# EAGLE design schematic (EAGLE 9.5.2)
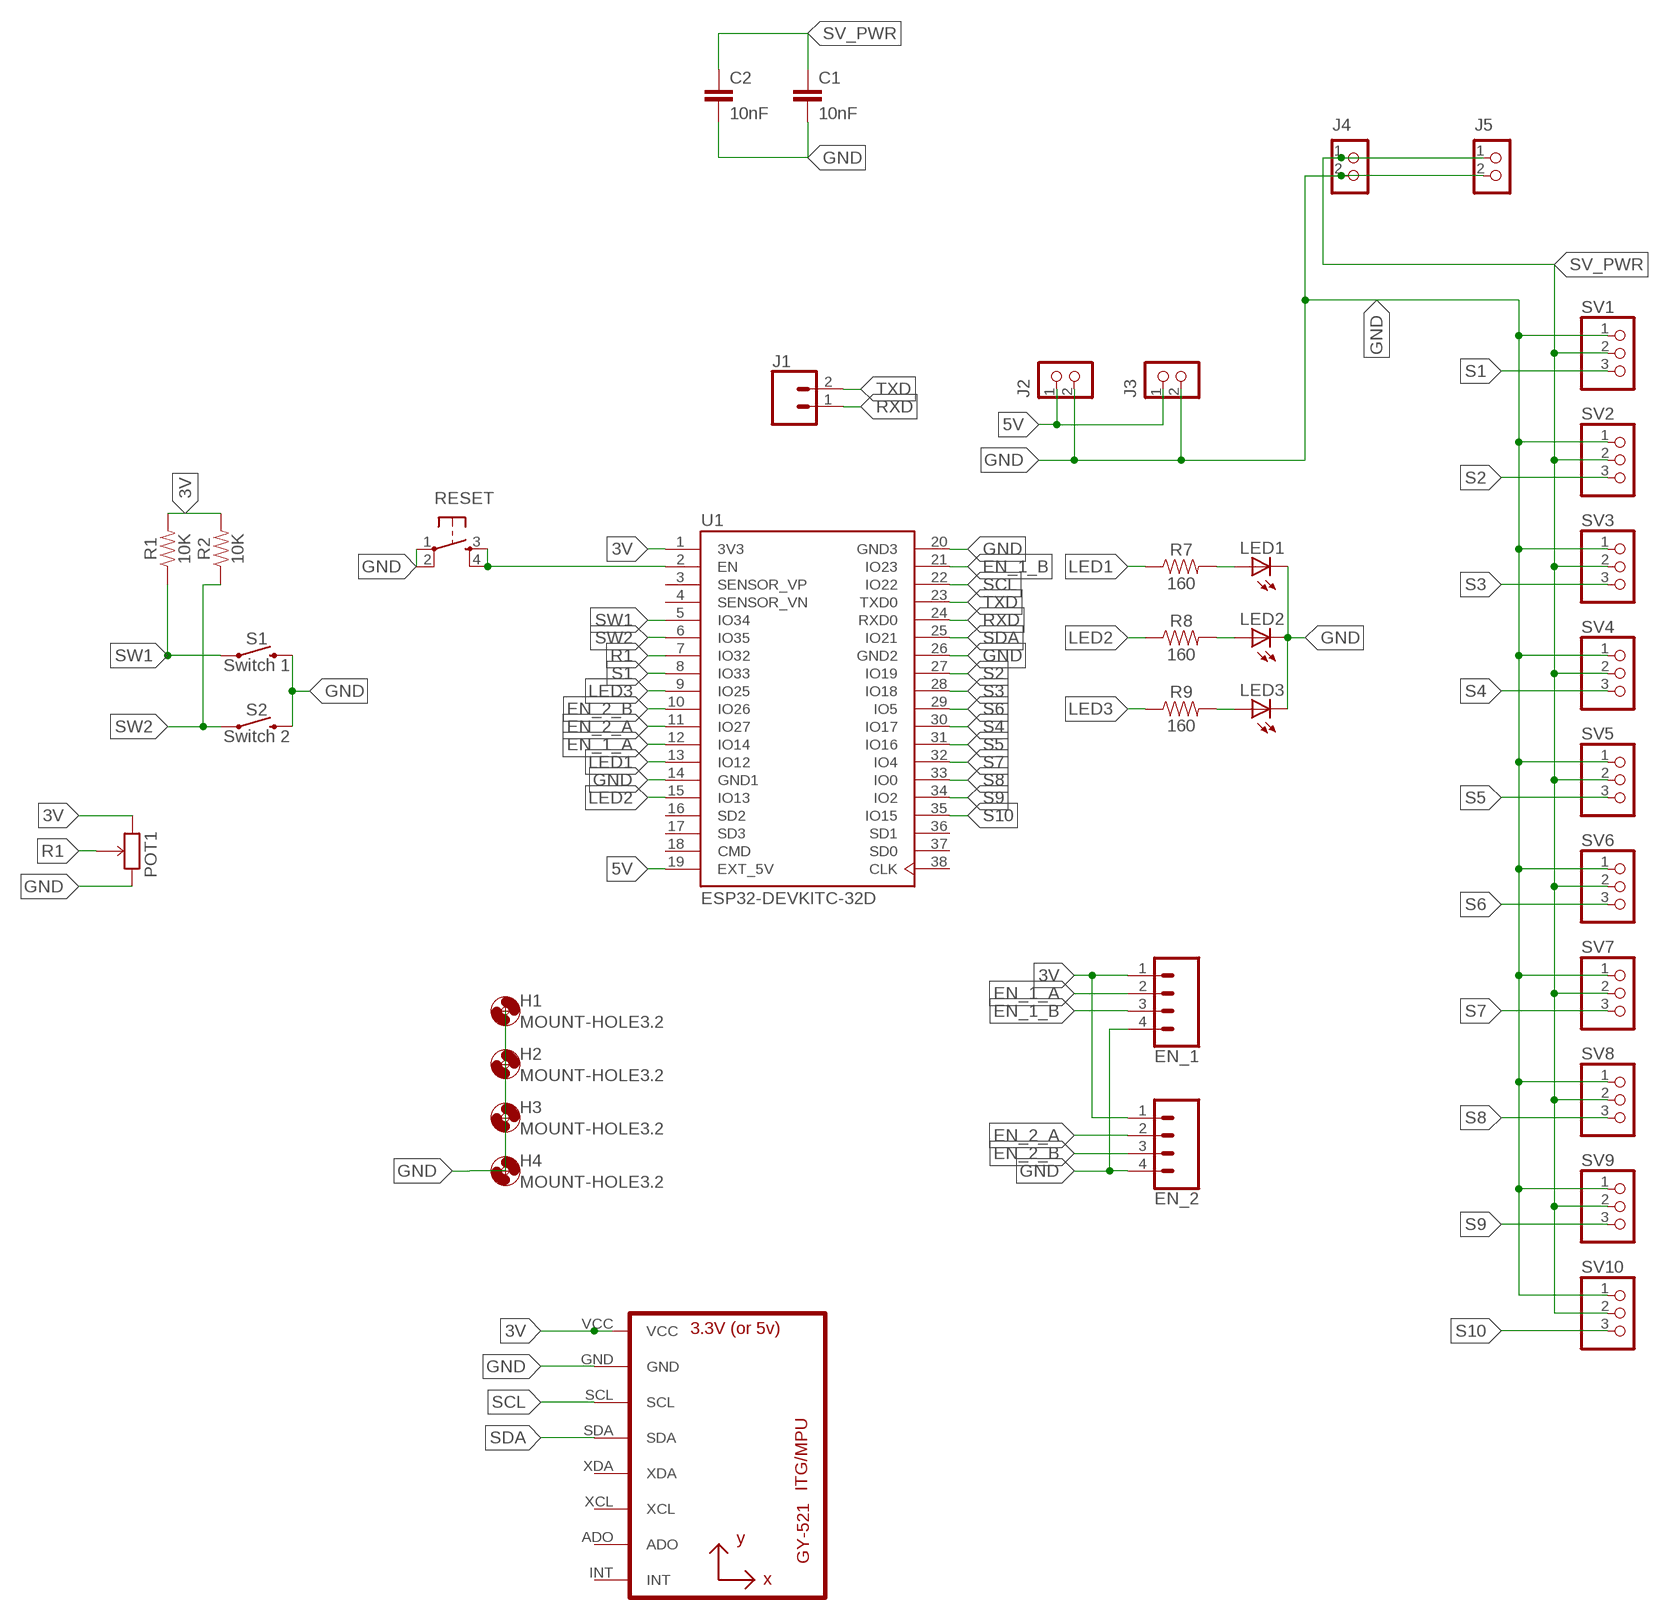
[diagram p0: schematic, sheet 1]

## Parts
C1  10nF  10NF-PTH-10MM-10000V-1-%  [CAP-PTH-10MM]
C2  10nF  10NF-PTH-10MM-10000V-1-%  [CAP-PTH-10MM]
EN_1  CONN_04  [1X04]
EN_2  CONN_04  [1X04]
H1  MOUNT-HOLE3.2  [3,2]
H2  MOUNT-HOLE3.2  [3,2]
H3  MOUNT-HOLE3.2  [3,2]
H4  MOUNT-HOLE3.2  [3,2]
J1  CONN_02  [1X02]
J2  CON_TERMINAL_BLOCK_02-5MM  [TERMINAL_BLOCK_2P_5]
J3  CON_TERMINAL_BLOCK_02-5MM  [TERMINAL_BLOCK_2P_5]
J4  CON_TERMINAL_BLOCK_02-5MM  [TERMINAL_BLOCK_2P_5]
J5  CON_TERMINAL_BLOCK_02-5MM  [TERMINAL_BLOCK_2P_5]
LED1  LED3MM  [LED3MM]
LED2  LED3MM  [LED3MM]
LED3  LED3MM  [LED3MM]
POT1  POTENTIOMETER_THT  [POTENTIOMETER]
R1  10K  10KOHM-HORIZ-1/4W-1%  [AXIAL-0.3]
R2  10K  10KOHM-HORIZ-1/4W-1%  [AXIAL-0.3]
R7  160  10KOHM-HORIZ-1/4W-1%  [AXIAL-0.3]
R8  160  10KOHM-HORIZ-1/4W-1%  [AXIAL-0.3]
R9  160  10KOHM-HORIZ-1/4W-1%  [AXIAL-0.3]
RESET  TAC_SWITCHPTH  [TACTILE-PTH]
S1  Switch 1  MOMENTARY-SWITCH-SPST-PTH-12MM  [TACTILE_SWITCH_PTH_12MM]
S2  Switch 2  MOMENTARY-SWITCH-SPST-PTH-12MM  [TACTILE_SWITCH_PTH_12MM]
SV1  PINHD-1X3  [1X03]
SV2  PINHD-1X3  [1X03]
SV3  PINHD-1X3  [1X03]
SV4  PINHD-1X3  [1X03]
SV5  PINHD-1X3  [1X03]
SV6  PINHD-1X3  [1X03]
SV7  PINHD-1X3  [1X03]
SV8  PINHD-1X3  [1X03]
SV9  PINHD-1X3  [1X03]
SV10  PINHD-1X3  [1X03]
U1  ESP32-DEVKITC-32D  [MODULE_ESP32-DEVKITC-32D]
U2  GY-521MPU6050  [GY-521]

## Nets
3V: EN_1.1 EN_2.1 POT1.3(CW) R1.P$2 R2.P$2 U1.1(3V3) U2.VCC
5V: J2.1 J3.1 U1.19(EXT_5V)
EN_1_A: EN_1.2 U1.12(IO14)
EN_1_B: EN_1.3 U1.21(IO23)
EN_2_A: EN_2.2 U1.11(IO27)
EN_2_B: EN_2.3 U1.10(IO26)
GND: C1.2 C2.2 EN_1.4 EN_2.4 J2.2 J3.2 J4.2 J5.2 LED1.K(C) LED2.K(C) LED3.K(C) POT1.1(CCW) RESET.1 RESET.2 S1.3 S2.3 SV1.1 SV2.1 SV3.1 SV4.1 SV5.1 SV6.1 SV7.1 SV8.1 SV9.1 SV10.1 U1.14(GND1) U1.20(GND3) U1.26(GND2) U2.GND
LED1: R7.P$1 U1.13(IO12)
LED2: R8.P$1 U1.15(IO13)
LED3: R9.P$1 U1.9(IO25)
N$1: RESET.3 RESET.4 U1.2(EN)
N$6: LED1.A R7.P$2
N$7: LED2.A R8.P$2
N$8: LED3.A R9.P$2
R1: POT1.2(WIPER) U1.7(IO32)
RXD: J1.1 U1.24(RXD0)
S1: SV1.3 U1.8(IO33)
S2: SV2.3 U1.27(IO19)
S3: SV3.3 U1.28(IO18)
S4: SV4.3 U1.30(IO17)
S5: SV5.3 U1.31(IO16)
S6: SV6.3 U1.29(IO5)
S7: SV7.3 U1.32(IO4)
S8: SV8.3 U1.33(IO0)
S9: SV9.3 U1.34(IO2)
S10: SV10.3 U1.35(IO15)
SCL: U1.22(IO22) U2.SCL
SDA: U1.25(IO21) U2.SDA
SV_PWR: C1.1 C2.1 J4.1 J5.1 SV1.2 SV2.2 SV3.2 SV4.2 SV5.2 SV6.2 SV7.2 SV8.2 SV9.2 SV10.2
SW1: R1.P$1 S1.1 U1.5(IO34)
SW2: R2.P$1 S2.1 U1.6(IO35)
TXD: J1.2 U1.23(TXD0)
Unconnected: U1.3(SENSOR_VP) U1.4(SENSOR_VN) U1.16(SD2) U1.17(SD3) U1.18(CMD) U1.36(SD1) U1.37(SD0) U1.38(CLK) U2.ADO U2.INT U2.XCL U2.XDA

## Library data of the parts
C1 C2 = SparkFun-Capacitors:10NF: 0.01uF/10nF/10,000pF ceramic capacitors A capacitor is a passive two-terminal electrical component used to store electrical energy temporarily in an electric field. CAP-09321; PROD_ID: CAP-09321
EN_1 EN_2 = SparkFun-Connectors:CONN_04: Multi connection point. Often used as Generic Header-pin footprint for 0.1 inch spaced/style header connections On any of the 0.1 inch spaced packages, you can populate with these: Break Away Headers - Straight <https://www.sparkfun.com/products/116> (PRT-00116) Break Away Male Headers - Right Angle <https://www.sparkfun.com/products/553> (PRT-00553) Female Headers <https://www.sparkfun.com/products/115> (PRT-00115) Break Away Headers - Machine Pin <https://www.sparkfun.com/products/117> (PRT-00117) Break Away Female Headers - Swiss Machine Pin <https://www.sparkfun.com/products/743> (PRT-00743) For SCREWTERMINALS and SPRING TERMINALS visit here: Screw Terimnals on SparkFun.com <https://www.sparkfun.com/search/results?term=Screw+Terminals> (5mm/3.5mm/2.54mm spacing) This device is also useful as a general connection point to wire up your design to another part of your project. Our various solder wires solder well into these plated through hole pads. Hook-Up Wire - Assortment (Stranded, 22 AWG) <https://www.sparkfun.com/products/11375> (PRT-11375) Hook-Up Wire - Assortment (Solid Core, 22 AWG) <https://www.sparkfun.com/products/11367> (PRT-11367) View the entire wire category on our website here <https://www.sparkfun.com/categories/141> Special notes: Molex polarized connector foot print use with SKU : PRT-08231 with associated crimp pins and housings. 1MM SMD Version SKU: PRT-10208; PROD_ID: CONN-09696
H1-H4 = holes:MOUNT-HOLE: MOUNTING HOLE with drill center marker
J1 = SparkFun-Connectors:CONN_02: Multi connection point. Often used as Generic Header-pin footprint for 0.1 inch spaced/style header connections On any of the 0.1 inch spaced packages, you can populate with these: Break Away Headers - Straight <https://www.sparkfun.com/products/116> (PRT-00116) Break Away Male Headers - Right Angle <https://www.sparkfun.com/products/553> (PRT-00553) Female Headers <https://www.sparkfun.com/products/115> (PRT-00115) Break Away Headers - Machine Pin <https://www.sparkfun.com/products/117> (PRT-00117) Break Away Female Headers - Swiss Machine Pin <https://www.sparkfun.com/products/743> (PRT-00743) For SCREWTERMINALS and SPRING TERMINALS visit here: Screw Terimnals on SparkFun.com <https://www.sparkfun.com/search/results?term=Screw+Terminals> (5mm/3.5mm/2.54mm spacing) This device is also useful as a general connection point to wire up your design to another part of your project. Our various solder wires solder well into these plated through hole pads. Hook-Up Wire - Assortment (Stranded, 22 AWG) <https://www.sparkfun.com/products/11375> (PRT-11375) Hook-Up Wire - Assortment (Solid Core, 22 AWG) <https://www.sparkfun.com/products/11367> (PRT-11367) View the entire wire category on our website here <https://www.sparkfun.com/categories/141> Special notes: Molex polarized connector foot print use with: PRT-08233 with associated crimp pins and housings. 2.54_SCREWTERM for use with PRT-10571. 3.5mm Screw Terminal footprints for PRT-08084 5mm Screw Terminal footprints for use with PRT-08432
J2-J5 = dp_devices.v6:CON_TERMINAL_BLOCK_02: 2 poles wire to board terminal block
LED1-LED3 = adafruit:LED: LED OSRAM: - CHIPLED LG R971, LG N971, LY N971, LG Q971, LY Q971, LO R971, LY R971 LH N974, LH R974 LS Q976, LO Q976, LY Q976 LO Q996 - Hyper CHIPLED LW Q18S LB Q993, LB Q99A, LB R99A - SideLED LS A670, LO A670, LY A670, LG A670, LP A670 LB A673, LV A673, LT A673, LW A673 LH A674 LY A675 LS A676, LA A676, LO A676, LY A676, LW A676 LS A679, LY A679, LG A679 - Hyper Micro SIDELED® LS Y876, LA Y876, LO Y876, LY Y876 LT Y87S - SmartLED LW L88C, LW L88S LB L89C, LB L89S, LG L890 LS L89K, LO L89K, LY L89K LS L896, LA L896, LO L896, LY L896 - TOPLED LS T670, LO T670, LY T670, LG T670, LP T670 LSG T670, LSP T670, LSY T670, LOP T670, LYG T670 LG T671, LOG T671, LSG T671 LB T673, LV T673, LT T673, LW T673 LH T674 LS T676, LA T676, LO T676, LY T676, LB T676, LH T676, LSB T676, LW T676 LB T67C, LV T67C, LT T67C, LS T67K, LO T67K, LY T67K, LW E67C LS E67B, LA E67B, LO E67B, LY E67B, LB E67C, LV E67C, LT E67C LW T67C LS T679, LY T679, LG T679 LS T770, LO T770, LY T770, LG T770, LP T770 LB T773, LV T773, LT T773, LW T773 LH T774 LS E675, LA E675, LY E675, LS T675 LS T776, LA T776, LO T776, LY T776, LB T776 LHGB T686 LT T68C, LB T68C - Hyper Mini TOPLED® LB M676 - Mini TOPLED Santana® LG M470 LS M47K, LO M47K, LY M47K Source: http://www.osram.convergy.de/
POT1 = GamePad:POTENTIOMETER: Potentiometer [Rapid - 68-0242]
R1 R2 R7-R9 = SparkFun-Resistors:10KOHM: 10kΩ resistor A resistor is a passive two-terminal electrical component that implements electrical resistance as a circuit element. Resistors act to reduce current flow, and, at the same time, act to lower voltage levels within circuits. - Wikipedia; PROD_ID: RES-12183; VALUE: 10k
RESET = SparkFun-Retired:TAC_SWITCH: Momentary Switch Button commonly used for reset or general input. Spark Fun Electronics SKU : COM-00097 SMT- SWCH-08247
S1 S2 = SparkFun-Switches:MOMENTARY-SWITCH-SPST: Momentary Switch (Pushbutton) - SPST Normally-open (NO) SPST momentary switches (buttons, pushbuttons). Variants PTH-12MM - 12mm square, through-hole Momentary Pushbutton Switch - 12mm Square <https://www.sparkfun.com/products/9190> (COM-09190) PTH-6.0MM, PTH-6.0MM-KIT - 6.0mm square, through-hole Mini Pushbutton Switch <https://www.sparkfun.com/products/97> (COM-00097) KIT package intended for soldering kit's - only one side of pads' copper is exposed. PTH-RIGHT-ANGLE-KIT - Right-angle, through-hole Right Angle Tactile Button <https://www.sparkfun.com/products/10791> - Used on SparkFun BigTime Watch Kit <https://www.sparkfun.com/products/11734> SMD-12MM - 12mm square, surface-mount Tactile Button - SMD (12mm) <https://www.sparkfun.com/products/12993> (COM-12993) Used on SparkFun PicoBoard <https://www.sparkfun.com/products/11888> SMD-4.5MM - 4.5mm Square Trackball Switch Used on SparkFun Blackberry Trackballer Breakout <https://www.sparkfun.com/products/13169> SMD-4.6MMX2.8MM - 4.60mm x 2.80mm, surface mount Used on SparkFun SAMD21 Mini Breakout <https://www.sparkfun.com/products/13664> SMD-5.2MM, SMD-5.2-REDUNDANT - 5.2mm square, surface-mount Mini Pushbutton Switch - SMD <https://www.sparkfun.com/products/8720> (COM-08720) Used on Arduino Pro Mini <https://www.sparkfun.com/products/11114> REDUNDANT package connects both switch circuits together SMD-6.0X3.5MM - 6.0 x 3.5mm, surface mount Momentary Reset Switch SMD <https://www.sparkfun.com/products/8229> (COM-08229) SMD-6.2MM-TALL - 6.2mm square, surface mount Tactile Button - SMD (6mm) <https://www.sparkfun.com/products/12992> Used on SparkFun Digital Sandbox <https://www.sparkfun.com/products/12651> SMD-RIGHT-ANGLE - Right-angle, surface mount Used on SparkFun Block for Intel® Edison - Arduino <https://www.sparkfun.com/products/13036>; PROD_ID: SWCH-09185; SF_SKU: COM-09190
SV1-SV10 = adafruit:PINHD-1X3: PIN HEADER
U1 = ESP32-DEVKITC-32D:ESP32-DEVKITC-32D: Eval Board For Esp-Wroom-32; AVAILABILITY: Unavailable; DESCRIPTION: EVAL BOARD FOR ESP-WROOM-32; MF: Espressif Systems; MP: ESP32-DEVKITC-32D; PACKAGE: None; PRICE: None
U2 = gy-521:GY-521

## Board
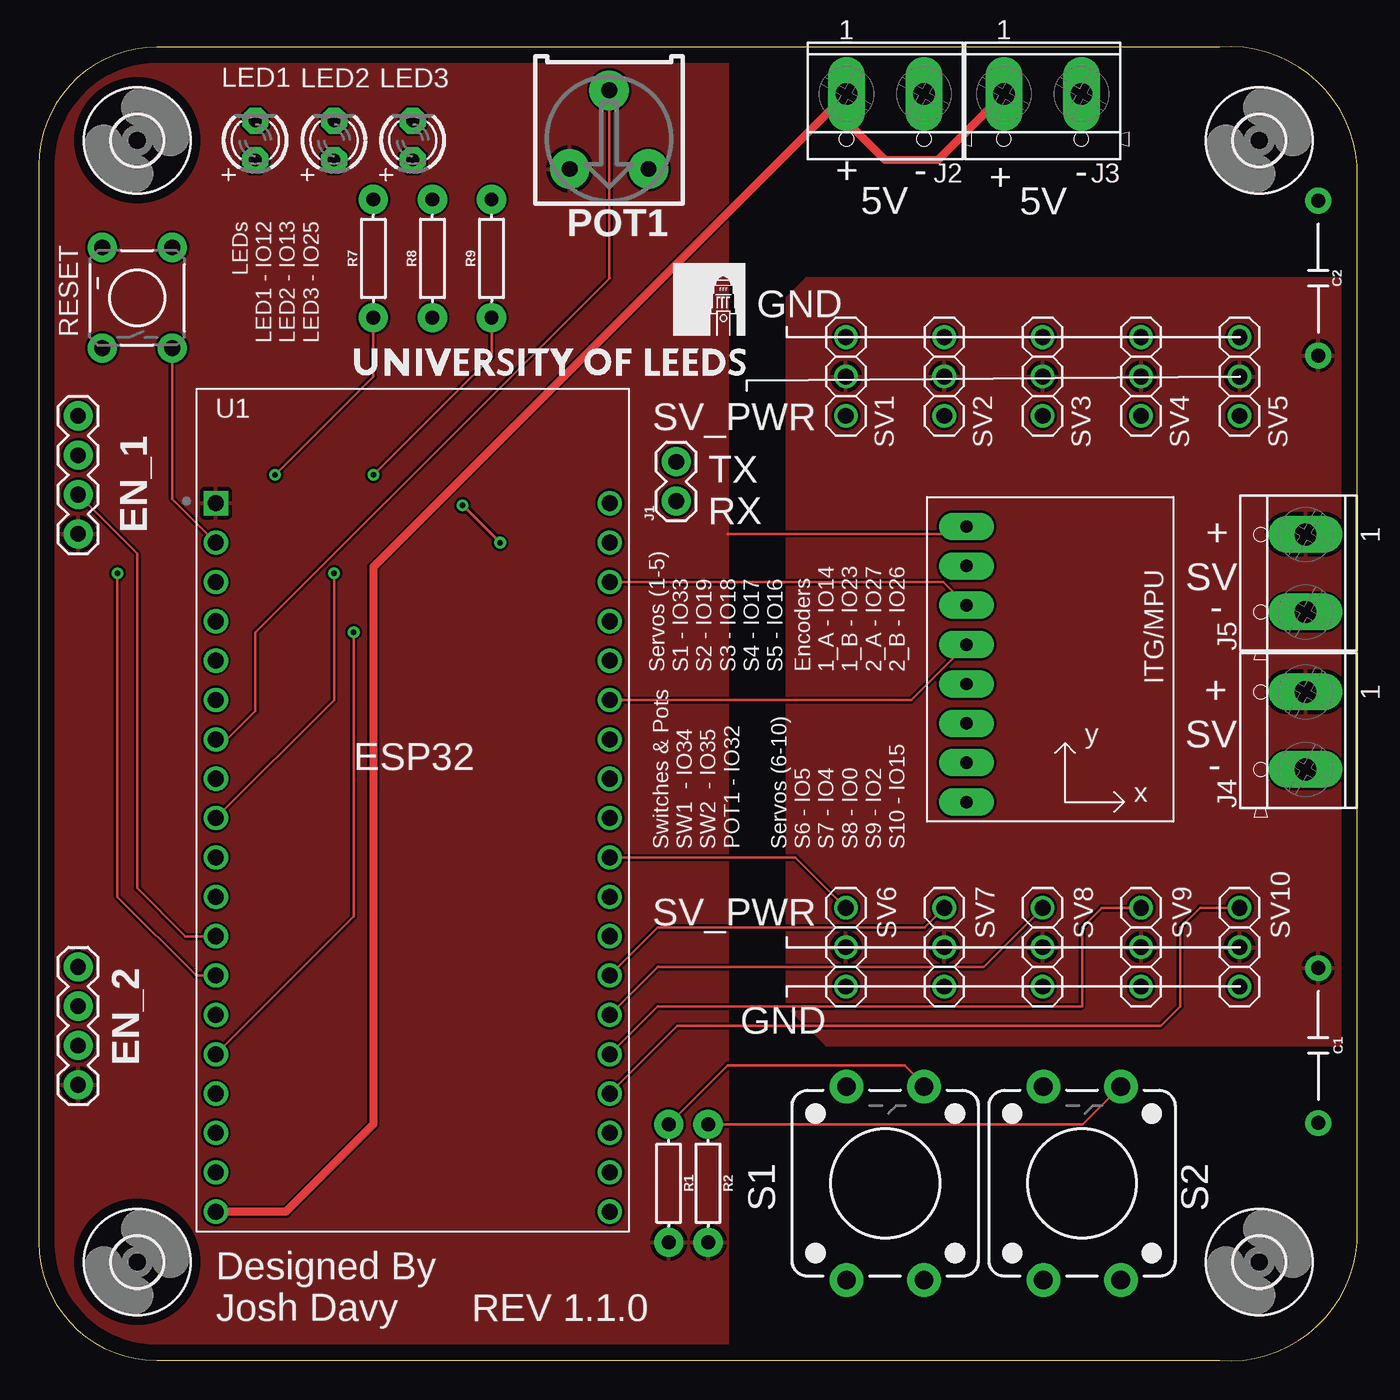
[diagram p1: board, top side]
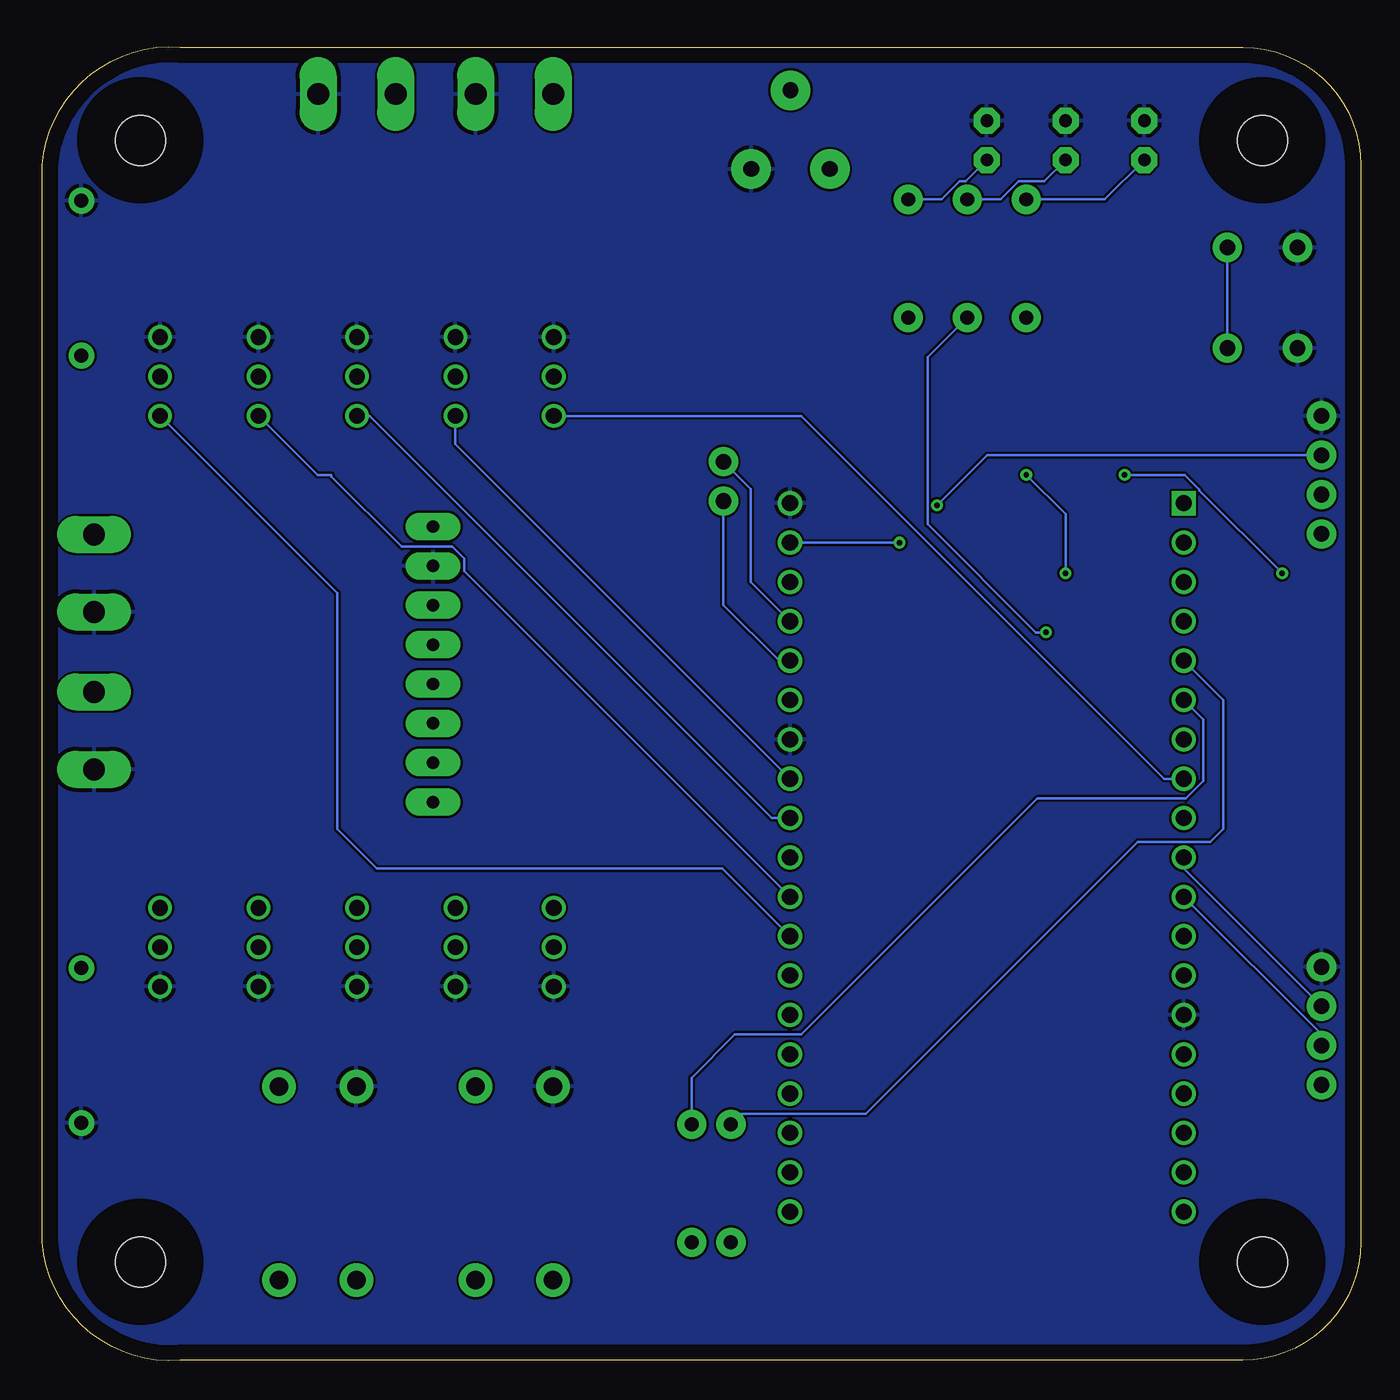
[diagram p2: board, bottom side, seen from below]

Size 85.07 x 84.81 mm. Coordinates in mm from the lower left corner, seen from the top.
Outline: 76.18,84.78 7.62,84.78 arc90 0,77.16 0,7.64 arc90 7.62,0.02 76.18,0.02 arc90 85.07,7.64 85.07,77.16 arc90 76.18,84.78
Copper layers (1*16): Top 0.035mm / dielectric 1.5mm / Bottom 0.035mm
Design rules "default": minimum track width 6mil, minimum drill 0.35mm, track to track 6mil, track to pad 6mil, pad to pad 6mil, via to via 6mil, smd to smd 6mil, copper to edge 40mil, drill to drill 6mil, minimum pad ring 10mil, minimum via ring 8mil, stop-mask expansion 4mil, vias tented up to drill 0mil, thermal gap 10mil

### Footprints (pad centres in the part's own frame; a part is rotated, then mirrored left to right if it is on the bottom)
CAP-PTH-10MM = drill 0.9 pad 1.651: 1 -5,0; 2 5,0
1X04 = drill 1.016 pad 1.88: 1 0,0; 2 2.54,0; 3 5.08,0; 4 7.62,0
3,2 = hole 3.2: 0,0
1X02 = drill 1.016 pad 1.88: 1 0,0; 2 2.54,0
TERMINAL_BLOCK_2P_5 = drill 1.4 pad 2.38 long: 1 2.5,-0.45; 2 -2.5,-0.45
LED3MM = drill 0.813 pad 1.676 octagon: A -1.27,0; K 1.27,0
POTENTIOMETER = drill 1.016 pad 2.54: 1 -2.54,2.525; 2 0,-2.555; 3 2.54,2.525
AXIAL-0.3 = drill 0.9 pad 1.88: P$1 -3.81,0; P$2 3.81,0
TACTILE-PTH = drill 1.016 pad 1.88: 1 -3.251,2.261; 2 3.251,2.261; 3 -3.251,-2.261; 4 3.251,-2.261
TACTILE_SWITCH_PTH_12MM = drill 1.2 pad 2.159: 1 6.25,-2.5; 2 -6.25,-2.5; 3 6.25,2.5; 4 -6.25,2.5
1X03 = drill 1.016: 1 -2.54,0; 2 0,0; 3 2.54,0
MODULE_ESP32-DEVKITC-32D = drill 1.04 square: 1 -12.7,19.76 | drill 1.04: 2 -12.7,17.22; 3 -12.7,14.68; 4 -12.7,12.14; 5 -12.7,9.6; 6 -12.7,7.06; 7 -12.7,4.52; 8 -12.7,1.98; 9 -12.7,-0.56; 10 -12.7,-3.1; 11 -12.7,-5.64; 12 -12.7,-8.18; 13 -12.7,-10.72; 14 -12.7,-13.26; 15 -12.7,-15.8; 16 -12.7,-18.34; 17 -12.7,-20.88; 18 -12.7,-23.42; 19 -12.7,-25.96; 20 12.7,19.76; 21 12.7,17.22; 22 12.7,14.68; 23 12.7,12.14; 24 12.7,9.6; 25 12.7,7.06; 26 12.7,4.52; 27 12.7,1.98; 28 12.7,-0.56; 29 12.7,-3.1; 30 12.7,-5.64; 31 12.7,-8.18; 32 12.7,-10.72; 33 12.7,-13.26; 34 12.7,-15.8; 35 12.7,-18.34; 36 12.7,-20.88; 37 12.7,-23.42; 38 12.7,-25.96
GY-521 = drill 0.8 pad 1.778 long: ADO -8.89,-6.35; GND -8.89,6.35; INT -8.89,-8.89; SCL -8.89,3.81; SDA -8.89,1.27; VCC -8.89,8.89; XCL -8.89,-3.81; XDA -8.89,-1.27

### Placement (x,y rotation side)
C1  82.55,20.34 270 top
C2  82.55,69.87 90 top
EN_1  2.54,53.36 90 top
EN_2  2.54,17.8 90 top
H1  6.35,6.37 0 top
H2  6.35,78.76 0 top
H3  78.74,78.76 0 top
H4  78.74,6.37 0 top
J1  41.12,55.48 90 top
J2  54.61,81.3 180 top
J3  64.77,81.3 180 top
J4  81.28,40.66 90 top
J5  81.28,50.82 90 top
LED1  13.97,78.76 90 top
LED2  19.05,78.76 90 top
LED3  24.13,78.76 90 top
POT1  36.8,79.44 180 top
R1  40.64,11.45 270 top
R2  43.18,11.45 270 top
R7  21.59,71.14 90 top
R8  25.4,71.14 90 top
R9  29.21,71.14 90 top
RESET  6.35,68.6 90 top
S1  54.61,11.45 90 top
S2  67.31,11.45 90 top
SV1  52.07,63.52 270 top
SV2  58.42,63.52 270 top
SV3  64.77,63.52 270 top
SV4  71.12,63.52 270 top
SV5  77.47,63.52 270 top
SV6  52.07,26.69 90 top
SV7  58.42,26.69 90 top
SV8  64.77,26.69 90 top
SV9  71.12,26.69 90 top
SV10  77.47,26.69 90 top
U1  24.13,35.58 0 top
U2  68.75,44.95 0 top
U$1  [LOGO_LARGE]  20.32,63.52 0 top

### Tracks (layer width: path | path; a pad name or v marks a point on that pad's centre or on a via)
3V
  Top 0.152: U2.VCC 59.38,53.36 44.45,53.36
  pour Top: -3.81,92.73 -3.81,-7.6 -2.54,-8.87 44.45,-8.87 44.45,92.73
5V
  Top 0.508: J3.1 58.01,77.49 54.61,77.49 52.11,79.99 J2.1 21.59,51.23 21.59,15.26 15.95,9.62 U1.19
EN_1_A
  Top 0.152: EN_1.2 6.35,52.09 6.35,30.5 9.45,27.4 U1.12
EN_1_B  (via drill 0.35)
  Top 0.2: v27.34,55.21 27.36,55.21 v29.77,52.8
  Bottom 0.152: U1.21 v29.77,52.8 | v27.34,55.21 24.11,58.44 EN_1.3
EN_2_A
  Bottom 0.152: U1.11 2.54,21.05 EN_2.2
EN_2_B
  Bottom 0.152: EN_2.3 11.43,31.77 U1.10
GND
  pour Bottom: -15.24,-29.19 -16.51,-30.46 66.04,-30.46 110.49,13.99 110.49,83.84 101.6,92.73 -10.16,92.73 -15.24,97.81 -15.24,91.46
LED1  (via drill 0.35)
  Top 0.152: U1.13 10.16,24.86 5.08,29.94 v5.08,50.82 | v15.24,57.17 21.59,63.52 R7.P$1
  Bottom 0.152: v5.08,50.82 10.42,56.16 10.42,56.22 11.38,57.17 v15.24,57.17
LED2  (via drill 0.35)
  Top 0.152: U1.15 20.32,28.67 v20.32,47.01
  Bottom 0.152: v20.32,47.01 20.96,47.01 27.95,54 27.95,64.79 R8.P$1
LED3  (via drill 0.35)
  Top 0.152: U1.9 19.05,42.64 v19.05,50.82 | v21.59,57.17 29.21,64.79 R9.P$1
  Bottom 0.152: v19.05,50.82 19.05,54.63 v21.59,57.17
N$1
  Top 0.152: U1.2 8.61,55.62 RESET.3
  Bottom 0.152: RESET.4 RESET.3
N$6
  Bottom 0.152: R7.P$2 16.51,74.95 LED1.A
N$7
  Bottom 0.152: R8.P$2 23.24,74.95 22.07,76.12 20.42,76.12 LED2.A
N$8
  Bottom 0.152: LED3.A 25.5,76.12 25.88,76.12 27.05,74.95 R9.P$2
R1
  Top 0.152: POT1.2 36.8,69.9 36.83,69.87 13.97,47.01 13.97,41.93 12.14,40.1 U1.7
RXD
  Bottom 0.152: J1.1 41.12,48.77 37.54,45.18 U1.24
S1
  Bottom 0.152: U1.8 12.7,37.56 36.12,60.98 SV1.3
S2
  Bottom 0.152: U1.27 58.42,59.15 SV2.3
S3
  Bottom 0.152: SV3.3 63.96,60.98 38,35.02 U1.28
S4
  Bottom 0.152: SV4.3 67.31,57.17 66.42,57.17 66.42,57.07 61.88,52.54 58.63,52.54 57.86,51.76 57.86,50.97 U1.30
S5
  Bottom 0.152: SV5.3 66.04,49.55 66.04,34.31 63.5,31.77 41.2,31.77 U1.31
S6
  Top 0.152: U1.29 48.82,32.48 SV6.3
S7
  Top 0.152: U1.32 39.93,27.96 57.15,27.96 SV7.3
S8
  Top 0.152: U1.33 39.93,25.42 60.96,25.42 SV8.3
S9
  Top 0.152: U1.34 39.93,22.88 67.31,22.88 67.31,27.96 68.58,29.23 SV9.3
S10
  Top 0.152: U1.35 41.2,21.61 72.39,21.61 73.66,22.88 73.66,27.96 74.93,29.23 SV10.3
SCL
  Top 0.152: U1.22 58.36,50.26 U2.SCL
SDA
  Top 0.152: U1.25 56.28,42.64 U2.SDA
SV_PWR
  pour Top: 92.71,69.87 49.53,69.87 48.26,68.6 48.26,22.88 50.8,20.34 92.71,20.34 93.98,21.61 93.98,68.6
SW1
  Top 0.152: R1.P$1 44.45,19.07 55.88,19.07 57.11,17.84 S1.1
  Bottom 0.152: U1.5 8.89,42.64 8.89,34.31 9.71,33.49 14.39,33.49 31.93,15.95 39.95,15.95 R1.P$1
SW2
  Top 0.152: S2.1 67.37,15.26 R2.P$1
  Bottom 0.152: U1.6 10.16,41.37 10.16,37.41 11.29,36.28 20.89,36.28 36.12,21.05 40.4,21.05 43.18,18.27 R2.P$1
TXD
  Bottom 0.152: U1.23 39.37,50.26 39.37,56.27 J1.2

### Text on the board
tNames: + | - | + | - | LEDs / LED1 - IO12 / LED2 - IO13 / LED3 - IO25 | 5V | 5V | GND | SV_PWR | TX | RX | + | SV | - | Servos (1-5) / S1 - IO33 / S2 - IO19 / S3 - IO18 / S4 - IO17 / S5 - IO16 | Encoders / 1_A - IO14 / 1_B - IO23 / 2_A - IO27 / 2_B - IO26 | + | SV | ESP32 | - | Switches & Pots / SW1 - IO34 / SW2 - IO35 / POT1 - IO32 | Servos (6-10) / S6 - IO5 / S7 - IO4 / S8 - IO0 / S9 - IO2 / S10 - IO15 | SV_PWR | GND | S1 | S2 | Designed By / Josh Davy | REV 1.1.0